# Altium schematic sheet Crystal.SchDoc
size A4; SheetNumber: 11; SheetTotal: 13
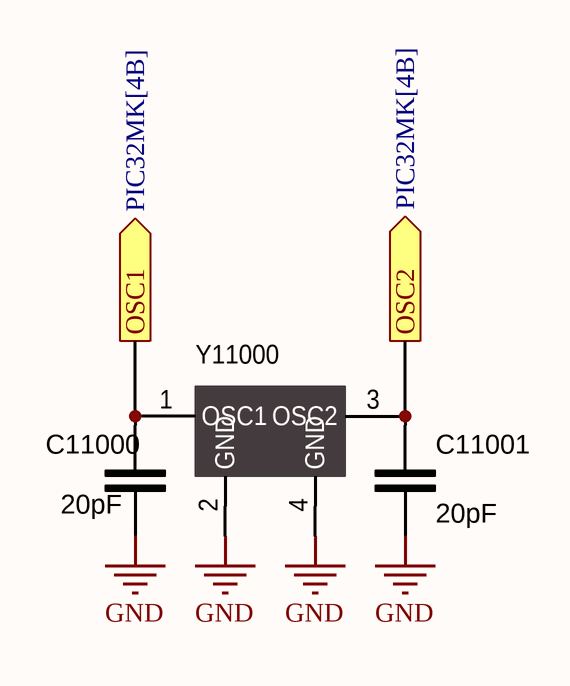
[diagram p0: Crystal.SchDoc]

## Parts
C11000  20pF  [CAP_0603]
C11001  20pF  [CAP_0603]
Y11000  8Hz  [ABM10]  (value not drawn)

## Ports
OSC1 (out, see PIC32MK[4B]), OSC2 (out, see PIC32MK[4B])

## Nets
GND: C11000.2 C11001.2 Y11000.2(GND) Y11000.4(GND)
OSC1: C11000.1 Y11000.1(OSC1) ; port OSC1
OSC2: C11001.1 Y11000.3(OSC2) ; port OSC2

## Library data of the parts
C11000 C11001 = C000007: CAP CER 100nF 0603 25V X7R; capaticanse: 100nf; ComponentLink1Description: digikey; ComponentLink1URL: https://www.digikey.com/en/products/detail/kyocera-avx/06033C104K4T2A/8019250
Y11000 = QUARTZ_8MHz: CRYSTAL 8.0000MHZ 18PF SMD; Manufacturer: ABRACON; Manufacturer Part Number: ABMM2-8.000MHZ-E2-T; id: 17; Frequency Stability: ±30ppm; Equivalent Series Resistance: 72 Ohm; item_id: 4360; Category: Crystals and Oscillators; Assembly: SMD; Datasheet URL: http://www.abracon.com/Resonators/ABMM2.pdf; Package Case: 4-SMD, No Lead (DFN, LCC); Frequency: 8Hz; Frequency Tolerance: ±30ppm; Load Capacitance: 18pF; Family: CRYSTAL; Size Dimension: 0.126" L x 0.098" W (3.20mm x 2.50mm); Part Type: Crystals, Oscillators